# Altium schematic sheet sensors.SchDoc
size A4; SheetNumber: 4; SheetTotal: 11
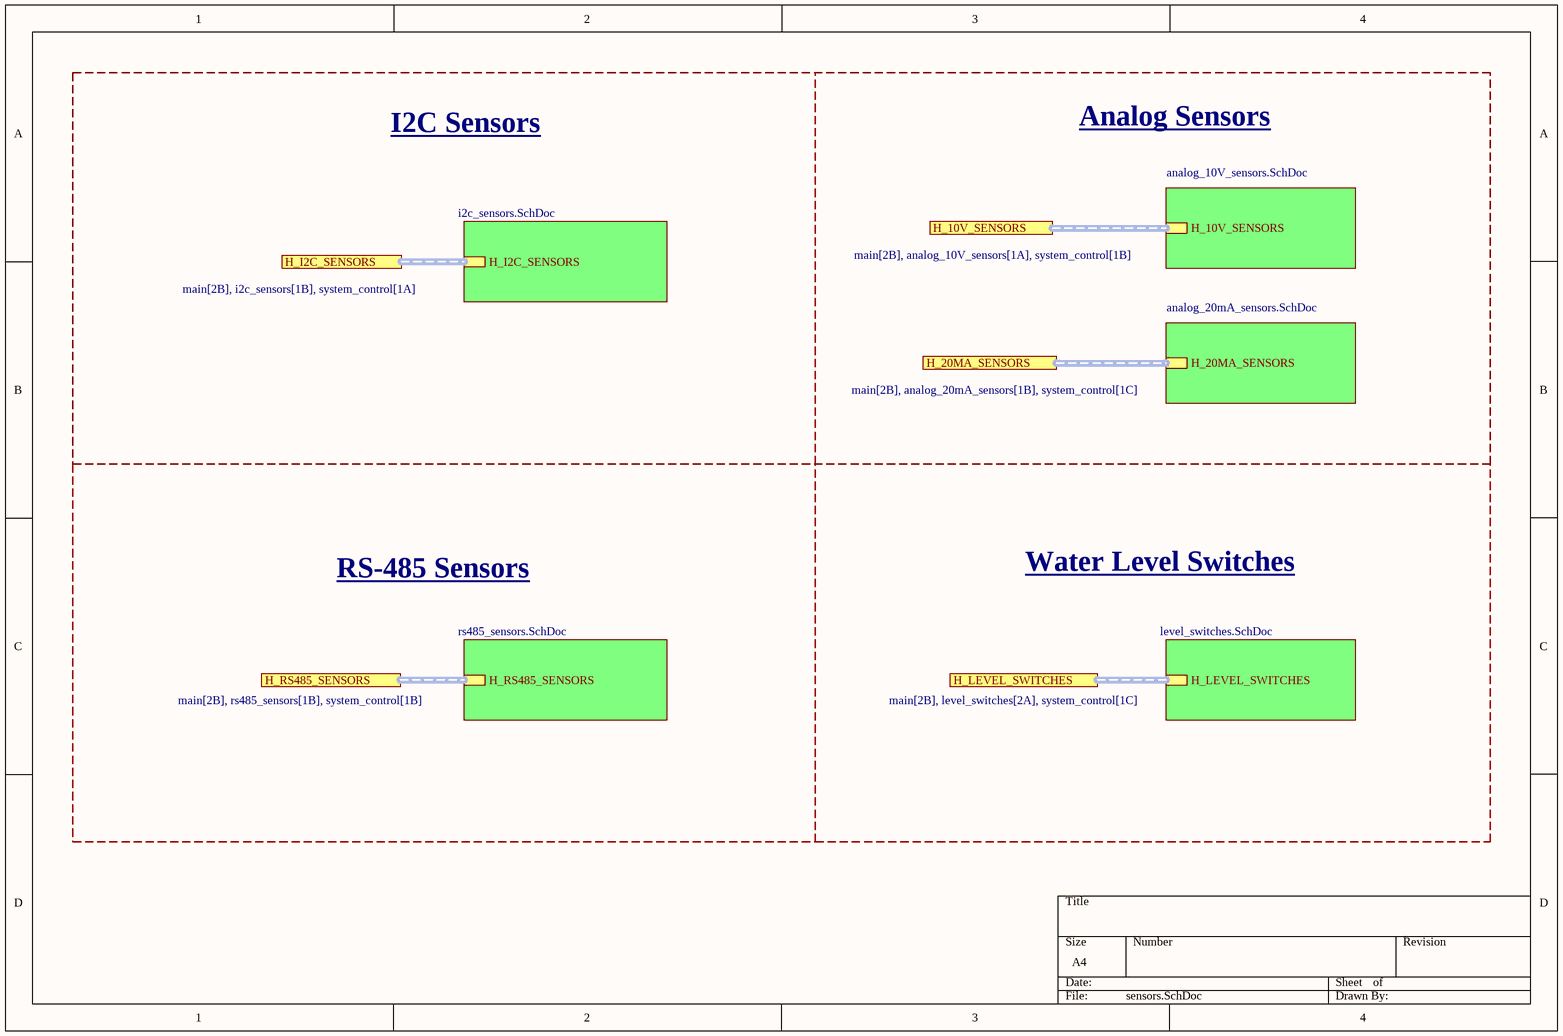
[diagram p0: sensors.SchDoc]

## Sub-sheets
level_switches = level_switches.SchDoc: H_LEVEL_SWITCHES (harness H_LEVEL_SWITCHES)
level_switches = analog_10V_sensors.SchDoc: H_10V_SENSORS (harness H_10V_SENSORS)
level_switches = analog_20mA_sensors.SchDoc: H_20MA_SENSORS (harness H_20MA_SENSORS)
soil_moisture_sensors = rs485_sensors.SchDoc: H_RS485_SENSORS (harness H_RS485_SENSORS)
soil_moisture_sensors = i2c_sensors.SchDoc: H_I2C_SENSORS (harness H_I2C_SENSORS)

## Ports
H_10V_SENSORS (harness H_ANALOG_SENSORS, see main[2B], analog_10V_sensors[1A], system_control[1B]), H_20MA_SENSORS (harness H_ANALOG_SENSORS, see main[2B], analog_20mA_sensors[1B], system_control[1C]), H_I2C_SENSORS (harness H_I2C_SENSORS, see main[2B], i2c_sensors[1B], system_control[1A]), H_LEVEL_SWITCHES (harness H_LEVEL_SENSORS, see main[2B], level_switches[2A], system_control[1C]), H_RS485_SENSORS (see main[2B], rs485_sensors[1B], system_control[1B])

## Buses and harness runs
harness port H_10V_SENSORS = sheet level_switches/H_10V_SENSORS
harness port H_20MA_SENSORS = sheet level_switches/H_20MA_SENSORS
harness port H_I2C_SENSORS = sheet soil_moisture_sensors/H_I2C_SENSORS
harness port H_LEVEL_SWITCHES = sheet level_switches/H_LEVEL_SWITCHES
harness port H_RS485_SENSORS = sheet soil_moisture_sensors/H_RS485_SENSORS

## Notes on the sheet
- I2C Sensors
- Analog Sensors
- RS-485 Sensors
- Water Level Switches